# Altium schematic sheet SWITCH.SchDoc: param:Title
size A4; Author: param.Autor; Version: param:Version
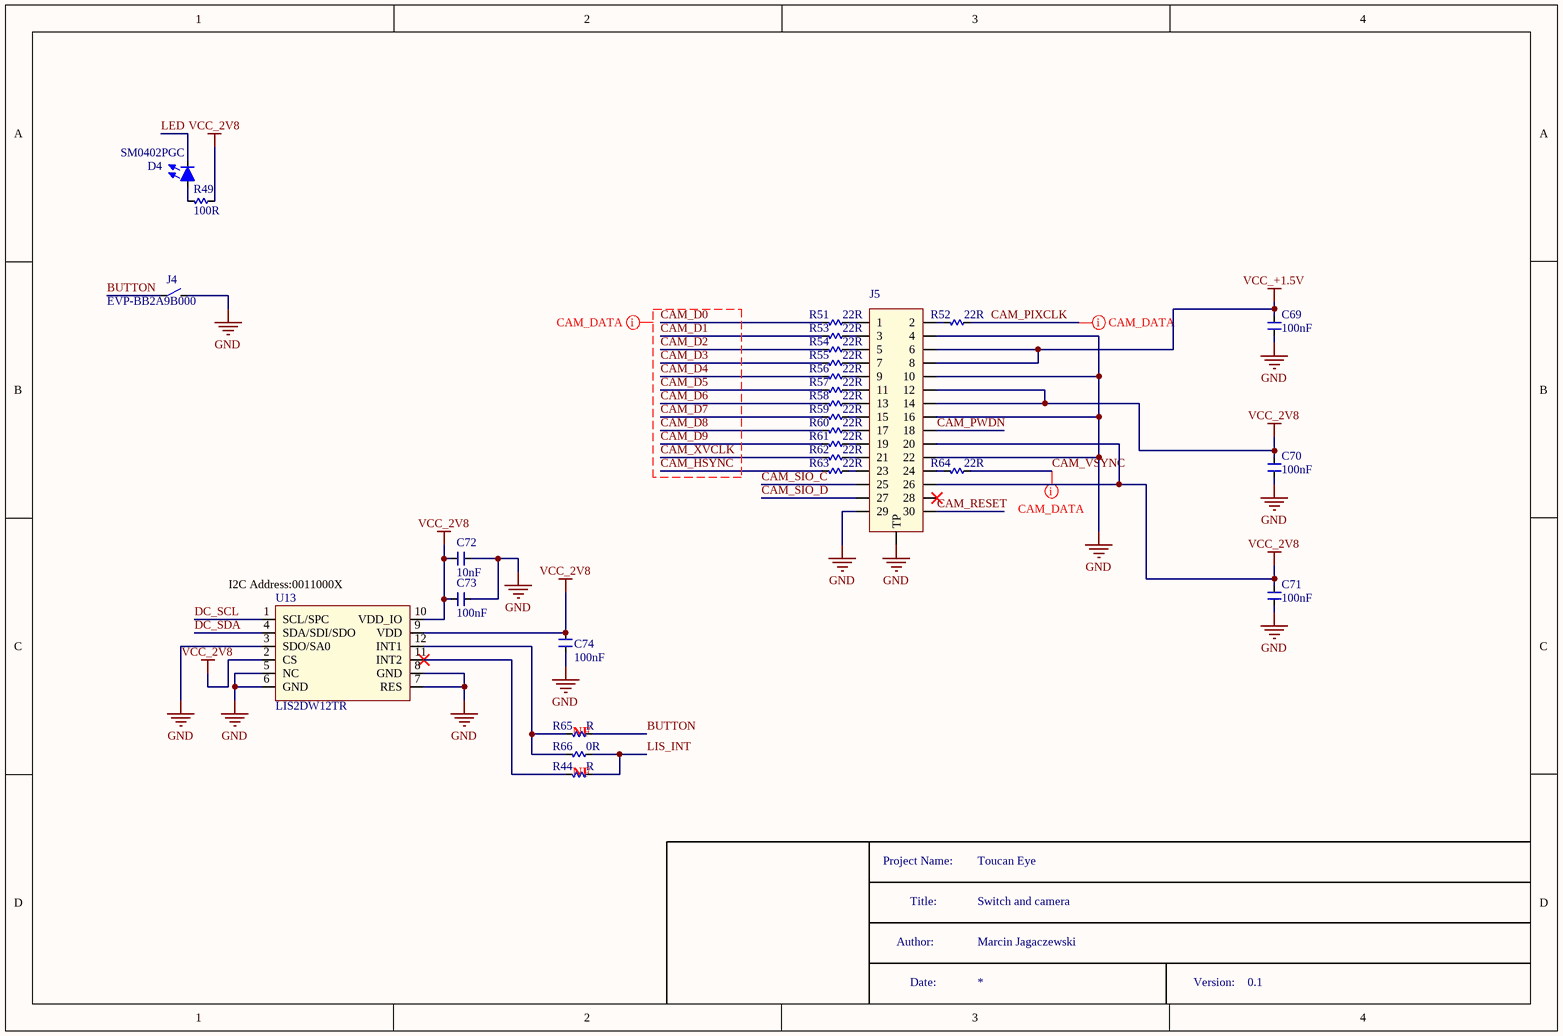
[diagram p0: SWITCH.SchDoc]

## Parts
C69  Capacitance: 100nF  [C_0201]  (hidden comment: C0201_100n_GRM033R6YA104KE14D)
C70  Capacitance: 100nF  [C_0201]  (hidden comment: C0201_100n_GRM033R6YA104KE14D)
C71  Capacitance: 100nF  [C_0201]  (hidden comment: C0201_100n_GRM033R6YA104KE14D)
C72  Capacitance: 10nF  [C_0402]  (hidden comment: C0402_10n_C0402C103K4PACTU)
C73  Capacitance: 100nF  [C_0201]  (hidden comment: C0201_100n_GRM033R6YA104KE14D)
C74  Capacitance: 100nF  [C_0201]  (hidden comment: C0201_100n_GRM033R6YA104KE14D)
D4  SM0402PGC  [LED0402]
J4  EVP-BB2A9B000  [CON_EVP-BB2A9B000]
J5  AXT530124  [AXT530124]  (value not drawn)
R44  value R  [R_0201_NF]  (hidden comment: (NDI)0201)  (no BOM)
R49  Resistance: 100R  [R_0201]  (hidden comment: R0201_100R_ERJ-1GNF1000C)
R51  Resistance: 22R  [R_0201]  (hidden comment: R0201_22R_ERJ-1GNF22R0C)
R52  Resistance: 22R  [R_0201]  (hidden comment: R0201_22R_ERJ-1GNF22R0C)
R53  Resistance: 22R  [R_0201]  (hidden comment: R0201_22R_ERJ-1GNF22R0C)
R54  Resistance: 22R  [R_0201]  (hidden comment: R0201_22R_ERJ-1GNF22R0C)
R55  Resistance: 22R  [R_0201]  (hidden comment: R0201_22R_ERJ-1GNF22R0C)
R56  Resistance: 22R  [R_0201]  (hidden comment: R0201_22R_ERJ-1GNF22R0C)
R57  Resistance: 22R  [R_0201]  (hidden comment: R0201_22R_ERJ-1GNF22R0C)
R58  Resistance: 22R  [R_0201]  (hidden comment: R0201_22R_ERJ-1GNF22R0C)
R59  Resistance: 22R  [R_0201]  (hidden comment: R0201_22R_ERJ-1GNF22R0C)
R60  Resistance: 22R  [R_0201]  (hidden comment: R0201_22R_ERJ-1GNF22R0C)
R61  Resistance: 22R  [R_0201]  (hidden comment: R0201_22R_ERJ-1GNF22R0C)
R62  Resistance: 22R  [R_0201]  (hidden comment: R0201_22R_ERJ-1GNF22R0C)
R63  Resistance: 22R  [R_0201]  (hidden comment: R0201_22R_ERJ-1GNF22R0C)
R64  Resistance: 22R  [R_0201]  (hidden comment: R0201_22R_ERJ-1GNF22R0C)
R65  value R  [R_0201_NF]  (hidden comment: (NDI)0201)  (no BOM)
R66  Resistance: 0R  [R_0201]  (hidden comment: R0201_0_ERJ-1GN0R00C)
U13  LIS2DW12TR  [LGA-12]

## Nets
GND: C69.1 C70.1 C71.1 C72.2 C73.2 C74.1 J4.2 J5.4 J5.10 J5.16 J5.22 J5.29 J5.TP U13.3(SDO/SA0) U13.5(NC) U13.6(GND) U13.7(RES) U13.8(GND)
VCC_2V8: C70.2 C71.2 C72.1 C73.1 C74.2 J5.12 J5.14 J5.20 J5.26 R49.2 U13.2(CS) U13.9(VDD) U13.10(VDD_IO)
VCC_+1.5V: C69.2 J5.6 J5.8
BUTTON: J4.1 R65.2
CAM_D0: R51.1
CAM_D1: R53.1
CAM_D2: R54.1
CAM_D3: R55.1
CAM_D4: R56.1
CAM_D5: R57.1
CAM_D6: R58.1
CAM_D7: R59.1
CAM_D8: R60.1
CAM_D9: R61.1
CAM_HSYNC: R63.1
CAM_PIXCLK: R52.2
CAM_PWDN: J5.18
CAM_RESET: J5.30
CAM_SIO_C: J5.25
CAM_SIO_D: J5.27
CAM_VSYNC: R64.2
CAM_XVCLK: R62.1
DC_SCL: U13.1(SCL/SPC)
DC_SDA: U13.4(SDA/SDI/SDO)
LED: D4.2(A)
LIS_INT: R44.2 R66.2
NetD4_1: D4.1(A) R49.1
NetJ5_1: J5.1 R51.2
NetJ5_2: J5.2 R52.1
NetJ5_3: J5.3 R53.2
NetJ5_5: J5.5 R54.2
NetJ5_7: J5.7 R55.2
NetJ5_9: J5.9 R56.2
NetJ5_11: J5.11 R57.2
NetJ5_13: J5.13 R58.2
NetJ5_15: J5.15 R59.2
NetJ5_17: J5.17 R60.2
NetJ5_19: J5.19 R61.2
NetJ5_21: J5.21 R62.2
NetJ5_23: J5.23 R63.2
NetJ5_24: J5.24 R64.1
NetR44_1: R44.1 U13.11(INT2)
NetR65_1: R65.1 R66.1 U13.12(INT1)

Not connected (* = marked no-connect by the designer): J5 28*

## Layout directives
net class CAM_DATA: CAM_D0, CAM_D1, CAM_D2, CAM_D3, CAM_D4, CAM_D5, CAM_D6, CAM_D7, CAM_D8, CAM_D9, CAM_HSYNC, CAM_PIXCLK, CAM_VSYNC, CAM_XVCLK

## Notes on the sheet
- (near U13) I2C Address:0011000X
- Project Name:
- Title:
- Switch and camera
- Toucan Eye
- Author:
- Date:
- Marcin Jagaczewski
- Version:
- 0.1
- (in symbol (NDI)0201) NF

## Library data of the parts
C69-C71 C73 C74 = C0201_100n_GRM033R6YA104KE14D: Multilayer Ceramic Capacitors MLCC - SMD/SMT 0201 0.10uF 35volts *Derate Voltage/Temp; Manufacturer: Murata; Tolerance: 10%; Dielectric: X5R; Voltage Rating (DC): 35V; Supplier 1: Mouser; Manufacturer Part Number: GRM033R6YA104KE14D; Stock 1: 295799; Pricing 1: 1=0.1, 10=0.061, 50=0.061, 100=0.027, 1000=0.015, 10000=0.01 (USD); Mount: Surface Mount; Case/Package: 0201; Weight: 1.2E-05oz; Case Code (Metric): 0603; Case Code (Imperial): 0201; Min Operating Temperature: -55°C; Max Operating Temperature: 85°C; Packaging: Tape and Reel; Voltage Rating: 35V; Termination: SMD/SMT; Package Quantity: 15000; Length: 0.024inch; Height: 0.3mm; Width: 0.3mm; Thickness: 0.013inch; ComponentLink1URL: http://www.mouser.com/ds/2/281/c02e-2905.pdf; ComponentLink1Description: http://www.mouser.com/ds/2/281/c02e-2905.pdf; ComponentLink2URL: http://search.murata.co.jp/Ceramy/image/img/A01X/partnumbering_e_01.pdf; ComponentLink2Description: http://search.murata.co.jp/Ceramy/image/img/A01X/partnumbering_e_01.pdf; *SCHChecked: *; *PCBChecked: *; Supplier Part Number 1: 81-GRM33R6YA104KE14D
C72 = C0402_10n_C0402C103K4PACTU: .010UF 16.0V; Manufacturer: KEMET; Dielectric Material: Ceramic; Dielectric: X5R; Voltage Rating (DC): 16V; Tolerance: 10%; *SCHChecked: 1; Supplier 1: Mouser; Manufacturer Part Number: C0402C103K4PACTU; Stock 1: 39404; Pricing 1: 1=0.11, 10=0.025, 50=0.025, 100=0.015, 1000=0.01, 10000=0.007 (USD); Case/Package: 0402; Lead Free: Lead Free; ComponentLink1URL: http://www.kemet.com/Lists/ProductCatalog/Attachments/19/KEM_C1006_X5R_SMD.pdf; ComponentLink1Description: http://www.kemet.com/Lists/ProductCatalog/Attachments/19/KEM_C1006_X5R_SMD.pdf; Supplier Part Number 1: 80-C0402C103K4P; *PCBChecked: 1
D4 = SM0402PGC: Manufacturer: Bivar; *SCHChecked: 1; Supplier 1: Mouser; Manufacturer Part Number: SM0402PGC; Stock 1: 3948; Pricing 1: 1=0.68, 10=0.44, 50=0.44, 100=0.379, 1000=0.228, 10000=0.184 (USD); *PCBChecked: 1; Supplier Part Number 1: 749-SM0402PGC
J4 = EVP-BB2A9B000: Tactile Switch SPST-NO Top Actuated Surface Mount; Manufacturer: Panasonic; Mechanical Life: 500000Cycles; Illumination Type: Non-Illuminated; Operating Force: 160gf; Throw Configuration: SPST; Switch Travel: 0.11mm; Switch Function: Off-Mom; *SCHChecked: 1; Supplier 1: Mouser; Manufacturer Part Number: EVP-BB2A9B000; Stock 1: 15065; Pricing 1: 1=0.7, 10=0.528, 50=0.528, 100=0.462, 1000=0.32, 10000=0.266 (USD); Mount: Surface Mount; Min Operating Temperature: -40°C; Max Operating Temperature: 85°C; Packaging: Tape and Reel; Termination: Gull Wing; Lead Free: Lead Free; ComponentLink1URL: //media.digikey.com/pdf/Data%20Sheets/Panasonic%20Switches%20PDFs/EVP-BB_Series_NPI.pdf; ComponentLink1Description: //media.digikey.com/pdf/Data%20Sheets/Panasonic%20Switches%20PDFs/EVP-BB_Series_NPI.pdf; Supplier Part Number 1: 667-EVP-BB2A9B000; *PCBChecked: 1
J5 = AXT530124: CONN SOCKET F4S .4MM 30POS SMD; Manufacturer: Panasonic; Number of Positions: 30; Contact Resistance: 90mR; Max Current Rating: 5A; Max Voltage Rating (DC): 60V; Current Rating: 300mA; Insulation Resistance: 1GR; Pitch: 0.4mm; *SCHChecked: 1; Supplier 1: Mouser; Manufacturer Part Number: AXT530124; Stock 1: 5060; Pricing 1: 1=2.05, 10=1.75, 50=1.75, 100=1.45, 1000=1.14, 10000=1.02 (USD); Mount: Surface Mount; Contact Plating: Nickel,Gold; Contact Material: Copper Alloy; Housing Material: Polymer; Min Operating Temperature: -55°C; Max Operating Temperature: 85°C; Package Quantity: 1; Number of Rows: 2; Packaging: Tape and Reel; Connector Type: Socket; Voltage Rating: 60V; Termination: Solder; Number of Contacts: 30; Max Voltage Rating (AC): 60V; Orientation: Straight; Length: 8.5mm; Depth: 3mm; Radiation Hardening: No; Lead Free: Lead Free; ComponentLink1URL: http://components.arrow.com/part/dataview/0323_03238060; ComponentLink1Description: http://components.arrow.com/part/dataview/0323_03238060; ComponentLink2URL: http://components.arrow.com/part/dataview/46992153S8061598N2972; ComponentLink2Description: http://components.arrow.com/part/dataview/46992153S8061598N2972; ComponentLink3URL: http://www.mouser.com/ds/2/315/f4s-catalog-1075850.pdf; ComponentLink3Description: http://www.mouser.com/ds/2/315/f4s-catalog-1075850.pdf; ComponentLink4URL: http://www.onlinecomponents.com/datasheet/axt530124.aspx?p=10552986; ComponentLink4Description: http://www.onlinecomponents.com/datasheet/axt530124.aspx?p=10552986; ComponentLink5URL: https://www.verical.com/server-webapp/html/getDatasheet?partID=80226; ComponentLink5Description: https://www.verical.com/server-webapp/html/getDatasheet?partID=80226; ComponentLink6URL: http://www3.panasonic.biz/ac/e_download/control/connector/base-fpc/catalog/con_eng_f4s.pdf; ComponentLink6Description: http://www3.panasonic.biz/ac/e_download/control/connector/base-fpc/catalog/con_eng_f4s.pdf; ComponentLink7URL: http://panasonic-denko.co.jp/ac/e_download/control/connector/base-fpc/catalog/con_eng_f4s.pdf?via=ok; ComponentLink7Description: http://panasonic-denko.co.jp/ac/e_download/control/connector/base-fpc/catalog/con_eng_f4s.pdf?via=ok; *PCBChecked: 1; Supplier Part Number 1: 769-AXT530124
R49 = R0201_100R_ERJ-1GNF1000C: RESISTOR, 0201, 0.05W, 1%, 100R; Manufacturer: Panasonic ECG; Temperature Coefficient: 200ppm/°C; Voltage Rating: 25V; Power Rating: 50mW; Supplier 1: Mouser; Manufacturer Part Number: ERJ-1GNF1000C; Stock 1: 169245; Pricing 1: 1=0.49, 10=0.045, 50=0.045, 100=0.018, 1000=0.013, 10000=0.007 (USD); Mount: Surface Mount; Case/Package: 0201; Number of Pins: 2; Weight: 6E-06oz; Contact Plating: Tin,Matte; Case Code (Metric): 0603; Case Code (Imperial): 0201; Min Operating Temperature: -55°C; Max Operating Temperature: 125°C; Tolerance: 1%; Composition: Thick Film; Packaging: Tape and Reel; Package Quantity: 15000; Number of Terminations: 2; Termination: SMD/SMT; Max Power Dissipation: 50mW; Military Standard: Not; Voltage Rating (DC): 25V; Length: 0.6mm; Height: 0.01inch; Width: 0.012inch; Depth: 0.3mm; Radiation Hardening: No; REACH SVHC: No SVHC; Lead Free: Lead Free; ComponentLink1URL: https://datasheet.ciiva.com/28514/1678782-28514079.pdf; ComponentLink1Description: https://datasheet.ciiva.com/28514/1678782-28514079.pdf; ComponentLink2URL: https://datasheet.ciiva.com/24162/aoa0000ce2-24162875.pdf; ComponentLink2Description: https://datasheet.ciiva.com/24162/aoa0000ce2-24162875.pdf; ComponentLink3URL: https://datasheet.ciiva.com/43467/1678782-43467030.pdf; ComponentLink3Description: https://datasheet.ciiva.com/43467/1678782-43467030.pdf; Supplier Part Number 1: 667-ERJ-1GNF1000C
R51-R64 = R0201_22R_ERJ-1GNF22R0C: RESISTOR, 0201, 0.05W, 1%, 22R; Manufacturer: Panasonic ECG; Temperature Coefficient: 200ppm/°C; Voltage Rating: 25V; Power Rating: 50mW; *SCHChecked: 1; Supplier 1: Mouser; Manufacturer Part Number: ERJ-1GNF22R0C; Stock 1: 64894; Pricing 1: 1=0.49, 10=0.045, 50=0.045, 100=0.018, 1000=0.013, 10000=0.007 (USD); Mount: Surface Mount; Case/Package: 0201; Number of Pins: 2; Case Code (Metric): 0603; Case Code (Imperial): 0201; Min Operating Temperature: -55°C; Max Operating Temperature: 125°C; Tolerance: 1%; Composition: Thick Film; Packaging: Tape and Reel; Package Quantity: 15000; Number of Terminations: 2; Max Power Dissipation: 50mW; Voltage Rating (DC): 25V; Length: 0.6mm; Height: 0.01inch; Width: 0.012inch; Radiation Hardening: No; REACH SVHC: No SVHC; ComponentLink1URL: https://datasheet.ciiva.com/22737/1678782-22737559.pdf; ComponentLink1Description: https://datasheet.ciiva.com/22737/1678782-22737559.pdf; ComponentLink2URL: https://datasheet.ciiva.com/24023/aoa0000ce2-24023549.pdf; ComponentLink2Description: https://datasheet.ciiva.com/24023/aoa0000ce2-24023549.pdf; ComponentLink3URL: https://datasheet.ciiva.com/46375/1678782-46375727.pdf; ComponentLink3Description: https://datasheet.ciiva.com/46375/1678782-46375727.pdf; ComponentLink4URL: https://datasheet.ciiva.com/22737/1678782-22737558.pdf; ComponentLink4Description: https://datasheet.ciiva.com/22737/1678782-22737558.pdf; ComponentLink5URL: https://datasheet.ciiva.com/43467/1678782-43467014.pdf; ComponentLink5Description: https://datasheet.ciiva.com/43467/1678782-43467014.pdf; ComponentLink6URL: https://datasheet.ciiva.com/7909/aoa0000ce2-7909159.pdf; ComponentLink6Description: https://datasheet.ciiva.com/7909/aoa0000ce2-7909159.pdf; Supplier Part Number 1: 667-ERJ-1GNF22R0C; *PCBChecked: 1
R66 = R0201_0_ERJ-1GN0R00C: RES SMD 0.0OHM JUMPER 1/20W 0201; Manufacturer: Panasonic; Power Rating: 50mW; Tolerance: 1%; Voltage Rating: 25V; Temperature Coefficient: 600ppm/°C; *PCBChecked: 1; Supplier 1: Mouser; Manufacturer Part Number: ERJ-1GN0R00C; Stock 1: 835293; Pricing 1: 1=0.21, 10=0.02, 50=0.02, 100=0.008, 1000=0.005, 10000=0.003 (USD); Mount: Surface Mount; Case/Package: 0201; Case Code (Imperial): 0201; Case Code (Metric): 0603; Contact Plating: Tin; Min Operating Temperature: -55°C; Max Operating Temperature: 125°C; Packaging: Tape and Reel; Package Quantity: 15000; Composition: Thick Film; Military Standard: Not; Voltage Rating (DC): 25V; Length: 0.6mm; Height: 0.23mm; Width: 0.3mm; Depth: 0.3mm; REACH SVHC: Unknown; Lead Free: Lead Free; ComponentLink1URL: https://datasheet.ciiva.com/22730/1678796-22730749.pdf; ComponentLink1Description: https://datasheet.ciiva.com/22730/1678796-22730749.pdf; *SCHChecked: 1; Supplier Part Number 1: 667-ERJ-1GN0R00C
U13 = LIS2DW12TR: Manufacturer: STMicroelectronics; *SCHChecked: 1; Supplier 1: Mouser; Manufacturer Part Number: LIS2DW12TR; Stock 1: 0; Supplier Part Number 1: 511-LIS2DW12TR; *PCBChecked: 1
R44 R65 = (NDI)0201: *SCHChecked: *; *PCBChecked: *